# Altium schematic sheet autonomiczny_odkurzacz_sch.SchDoc
size A4; SheetNumber: 1; SheetTotal: 1
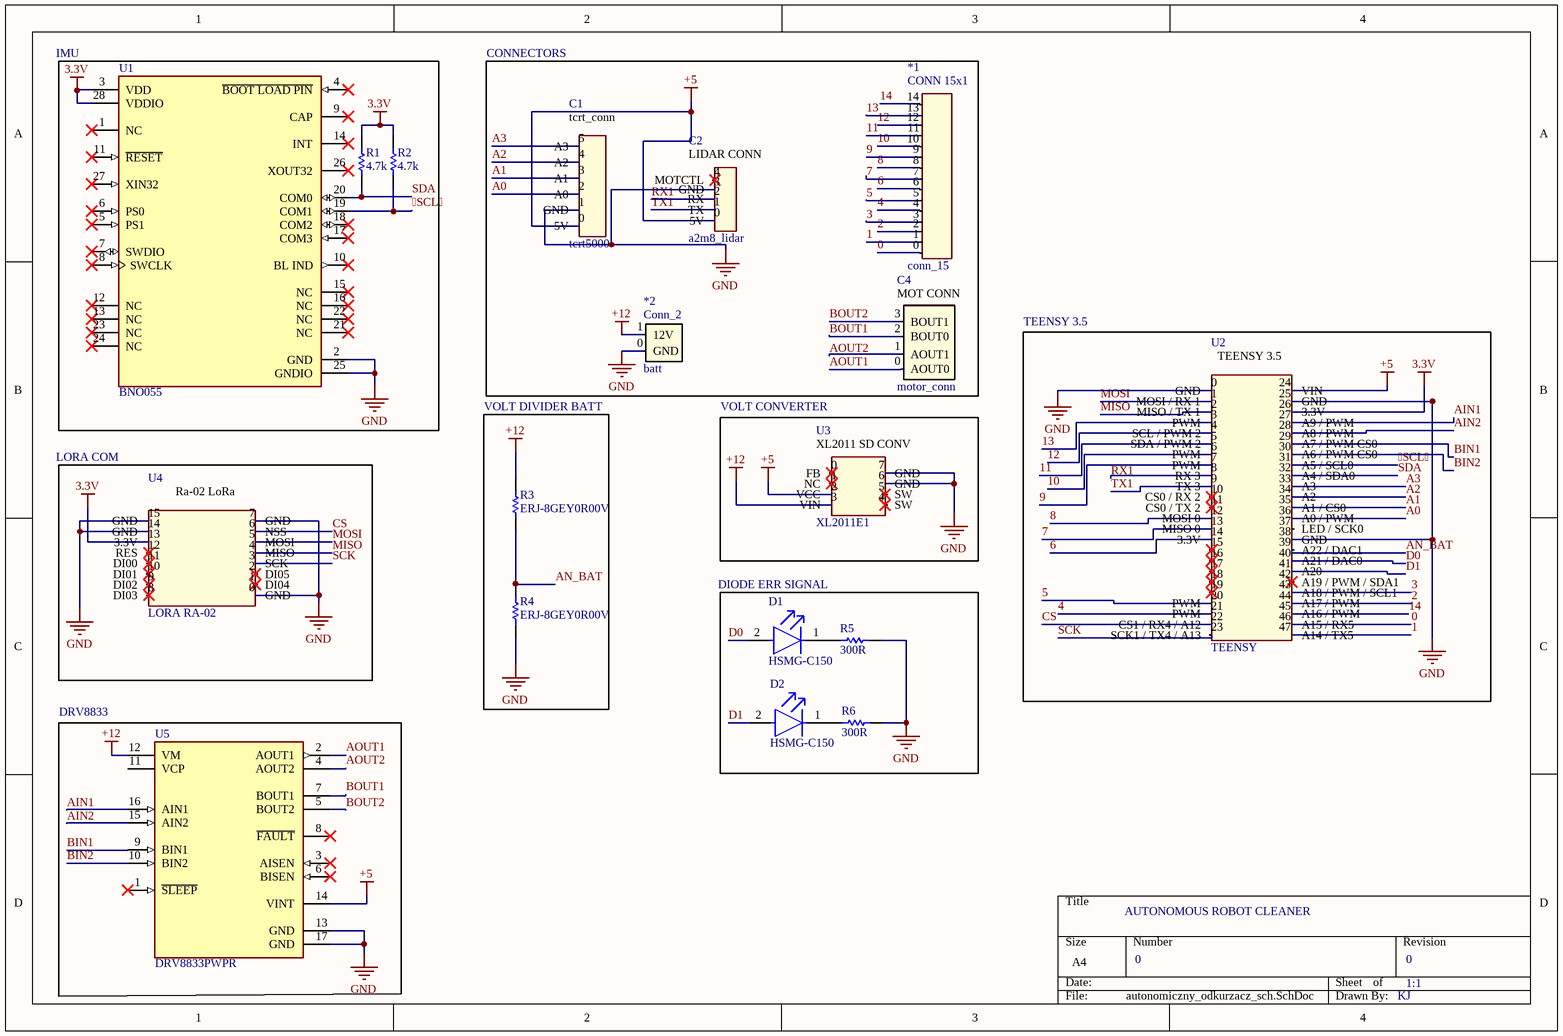
[diagram p0: autonomiczny_odkurzacz_sch.SchDoc]

## Parts
*1  conn_15  [PCBComponent_1]
*2  batt  [conn_2]
C1  tcrt5000  [PCBComponent_1]
C2  a2m8_lidar  [PCBComponent_1]
C4  motor_conn  [PCBComponent_1]
D1  HSMG-C150  [FP-HSMG-C150-MFG]
D2  HSMG-C150  [FP-HSMG-C150-MFG]
R1  4.7k  [RESC3216X70X50NL05T20]
R2  4.7k  [RESC3216X70X50NL05T20]
R3  ERJ-8GEY0R00V  [RESC3216X70X50NL05T20]
R4  ERJ-8GEY0R00V  [RESC3216X70X50NL05T20]
R5  300R  [RESC3216X70X50NL05T20]
R6  300R  [RESC3216X70X50NL05T20]
U1  BNO055  [FP-BNO055-MFG]
U2  TEENSY  [PCBComponent_1]
U3  XL2011E1  [PCBComponent_1]
U4  LORA RA-02  [PCBComponent_1]
U5  DRV8833PWPR  [FP-PWP0016C-IPC_A]

## Blocks framed on the sheet
IMU: R1 R2 U1
CONNECTORS: *1 *2 C1 C2 C4
TEENSY 3.5: U2
VOLT DIVIDER BATT: R3 R4
LORA COM: U4
DRV8833: U5

## Nets
3.3V: R1.2 R2.2 U1.3(VDD) U1.28(VDDIO) U2.26(3.3V) U4.13(3.3V)
+5: C1.0(5V) C2.0(5V) U2.24(VIN) U3.2(VCC) U5.14(VINT)
+12: *2.1(12V) R3.2 U3.3(VIN) U5.12(VM)
GND: *2.0(GND) C1.1(GND) C2.3(GND) R4.1 R5.2 R6.2 U1.2(GND) U1.25(GNDIO) U2.0(GND) U2.25(GND) U2.38(GND) U3.6(GND) U3.7(GND) U4.0(GND) U4.7(GND) U4.14(GND) U4.15(GND) U5.13(GND) U5.17(GND)
0: *1.0 U2.46(A15_/_RX5)
1: *1.1 U2.47(A14_/_TX5)
2: *1.2 U2.44(A17_/_PWM)
3: *1.3 U2.43(A18_/_PWM_/_SCL1)
4: *1.4 U2.21(PWM)
5: *1.5 U2.20(PWM)
6: *1.6 U2.14(3.3V)
7: *1.7 U2.13(MISO_0)
8: *1.8 U2.12(MOSI_0)
9: *1.9 U2.7(PWM)
10: *1.10 U2.6(PWM)
11: *1.11 U2.5(SDA_/_PWM_2)
12: *1.12 U2.4(SCL_/_PWM_2)
13: *1.13 U2.3(PWM)
14: *1.14 U2.45(A16_/_PWM)
SCL: R2.1 U1.19(COM1) U2.31(A5_/_SCL0)
A0: C1.2(A0) U2.36(A0_/_PWM)
A1: C1.3(A1) U2.35(A1_/_CS0)
A2: C1.4(A2) U2.34(A2)
A3: C1.5(A3) U2.33(A3)
AIN1: U2.27(A9_/_PWM) U5.16(AIN1)
AIN2: U2.28(A8_/_PWM) U5.15(AIN2)
AN_BAT: R3.1 R4.2 U2.39(A22_/_DAC1)
AOUT1: C4.0(AOUT0) U5.2(AOUT1)
AOUT2: C4.1(AOUT1) U5.4(AOUT2)
BIN1: U2.29(A7_/_PWM_CS0) U5.9(BIN1)
BIN2: U2.30(A6_/_PWM_CS0) U5.10(BIN2)
BOUT1: C4.2(BOUT0) U5.7(BOUT1)
BOUT2: C4.3(BOUT1) U5.5(BOUT2)
CS: U2.22(CS1_/_RX4_/_A12) U4.6(NSS)
D0: D1.2(A) U2.40(A21_/_DAC0)
D1: D2.2(A) U2.41(A20)
MISO: U2.2(MISO_/_TX_1) U4.4(MISO)
MOSI: U2.1(MOSI_/_RX_1) U4.5(MOSI)
RX1: C2.2(RX) U2.8(RX_3)
SCK: U2.23(SCK1_/_TX4_/_A13) U4.3(SCK)
SDA: R1.1 U1.20(COM0) U2.32(A4_/_SDA0)
TX1: C2.1(TX) U2.9(TX_3)
NetD1_1: D1.1(C) R5.1
NetD2_1: D2.1(C) R6.1

Not connected (* = marked no-connect by the designer): C2 4(MOTCTL)*; U1 1(NC)* 4(~{BOOT_LOAD_PIN})* 5(PS1)* 6(PS0)* 7(SWDIO)* 8(SWCLK)* 9(CAP)* 10(BL_IND)* 11(~{RESET})* 12(NC)* 13(NC)* 14(INT)* 15(NC)* 16(NC)* 17(COM3)* 18(COM2)* 21(NC)* 22(NC)* 23(NC)* 24(NC)* 26(XOUT32)* 27(XIN32)*; U2 10(CS0_/_RX_2)* 11(CS0_/_TX_2)* 15* 16* 17* 18* 19* 37(LED_/_SCK0) 42(A19_/_PWM_/_SDA1)*; U3 0(FB)* 1(NC)* 4(SW)* 5(SW)*; U4 1(DI04)* 2(DI05)* 8(DI03)* 9(DI02)* 10(DI01)* 11(DI00)* 12(RES)*; U5 1(~{SLEEP})* 3(AISEN)* 6(BISEN)* 8(~{FAULT})* 11(VCP)

## Notes on the sheet
- VOLT CONVERTER
- DIODE ERR SIGNAL
- AUTONOMOUS ROBOT CLEANER
- 0
- 1:1
- KJ
- (in symbol a2m8_lidar) LIDAR CONN
- (in symbol CMP-005-000004-1) tcrt_conn
- (in symbol CMP-005-000018-1) XL2011 SD CONV
- (in symbol CMP-005-000022-1) TEENSY 3.5
- (in symbol CMP-005-000023-1) CONN 15x1
- (in symbol CMP-005-000026-1) MOT CONN
- (in symbol conn_2) Conn_2
- (in symbol lora_ra02) Ra-02 LoRa

## Library data of the parts
*1 = CMP-005-000023-1: Design Item ID: conn_15; Source: MySchLib.SchLib
*2 = conn_2
C1 = CMP-005-000004-1: Source: MySchLib.SchLib; Design Item ID: tcrt
C4 = CMP-005-000026-1: Design Item ID: motor_conn; Source: MySchLib.SchLib
D1 D2 = CMP-2000-05061-2: LED GREEN DIFFUSED 1206 SMD; Manufacturer: Broadcom; Led Orientation: Top View; Max Junction Temp: +95°C; Peak Emmision Wavelength: 570nm; Viewing Angle: 170°; Wavelength: 572nm; Reverse Voltage: 5V; Luminous Intensity: 15mcd; Forward Voltage: 2.2V; Power Dissipation: 65mW; Forward Current: 20mA; ComponentLink2Description: Datasheet; Lead Free: Yes; Temperature Range Low: -40°C; Package: HSMG-C150; Digikey Description: LED GREEN DIFFUSED 1206 SMD; Mouser Description: LED Uni-Color Green 570nm 2-Pin Chip LED T/R; Manufacturer Part Number: HSMG-C150; Temperature Range High: +85°C; Device Class L1: Optoelectronics; Colour: Green; Category: Diode; Device Class L3: unset; RoHS: TRUE; Height: 1.2mm; ComponentLink2URL: https://docs.broadcom.com/docs/AV02-0551EN; Device Class L2: LEDs; Automotive: No; Ipc Land Pattern Name: DIOCP320160X55; Octopart: https://octopart.com/hsmg-c150-broadcom-71131304; Temperature: -40°C to +85°C
R1 R2 R5 R6 = CMP-2003-00541-1: Manufacturer: Panasonic; Part Number: ERJ-8GEY0R00V
R3 R4 = CMP-2003-00541-1: Manufacturer: Panasonic; Part Number: ERJ-8GEY0R00V
U1 = CMP-2000-05075-4: IMU ACCEL/GYRO/MAG I2C 28LGA; Sensor Type: Accelerometer; Packaging: Tape and Reel; Case/Package: LGA; Min Operating Temperature: -40°C; Mount: Surface Mount; Output Type: I2C; Lead Free: Lead Free; Max Operating Temperature: 85°C
U2 = CMP-005-000022-1: Source: MySchLib.SchLib; Design Item ID: teensy_3_5
U3 = CMP-005-000018-1: Source: MySchLib.SchLib; Design Item ID: xl2011e1
U4 = lora_ra02
U5 = CMP-1529-00004-3: IC MOTOR DRIVER PAR 16HTSSOP; Supply Current: 3mA; Max Output Current: 2A; Interface: PWM; Output Current: 1.5A; Max Supply Voltage: 10.8V; Fault Protection: Over Temperature; Number of Outputs: 2; Min Supply Voltage: 2.7V; Nominal Supply Current: 3mA; Series: DRV8833; Min Operating Temperature: -40°C; Package Quantity: 2000; Packaging: Tape and Reel; Case/Package: HTSSOP; Output Current per Channel: 1.5A; RoHS Compliant: Yes; RMS Current (Irms): 1.5A; Max Operating Temperature: 85°C; Technology: NMOS; Number of Pins: 16; Radiation Hardening: No; Lead Free: Lead Free; REACH SVHC: No SVHC